# EAGLE design PocketLEDs (EAGLE 7.7.0)
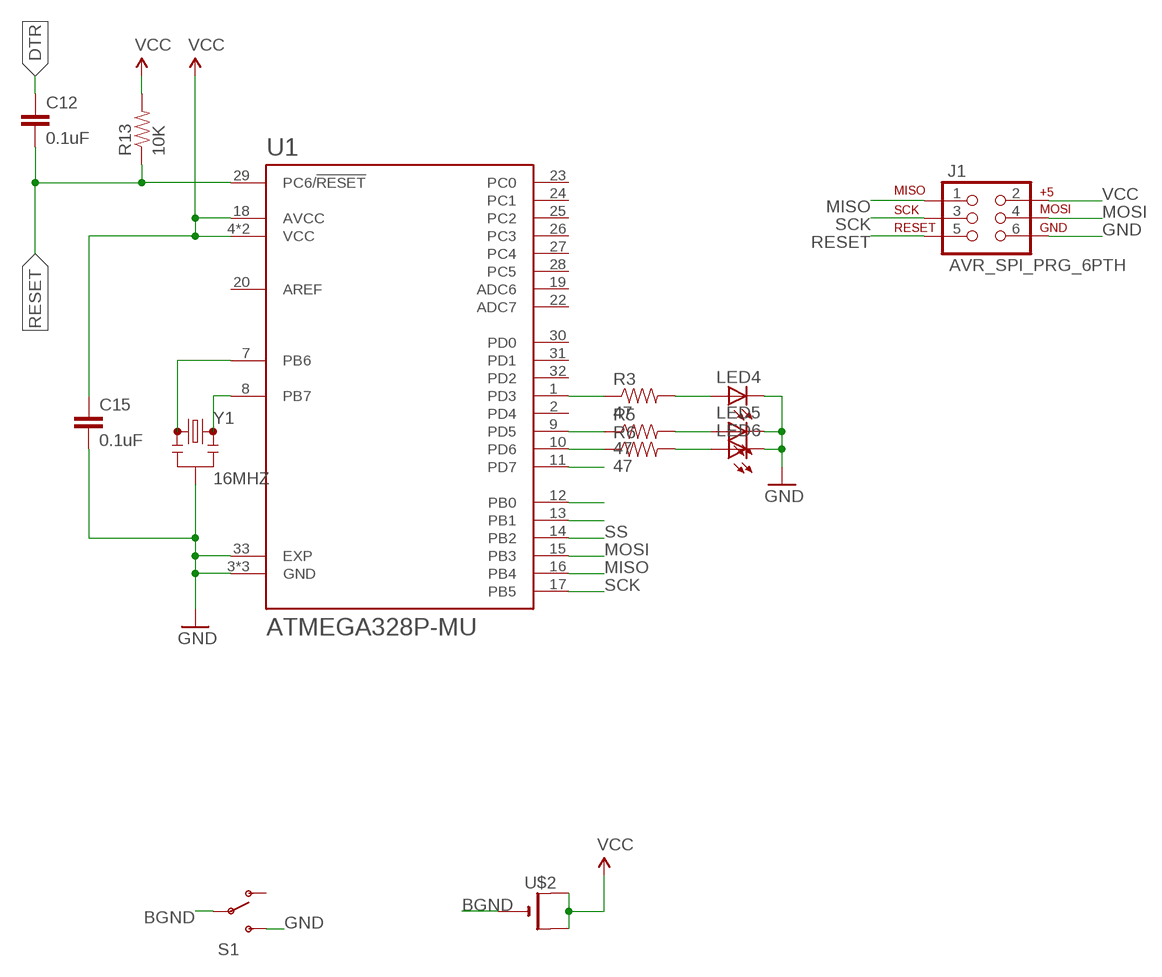
[diagram p0: schematic, sheet 1]

## Parts
C12  0.1uF  CAP0805  [0805]
C15  0.1uF  CAP0805  [0805]
J1  AVR_SPI_PRG_6PTH  [2X3]
LED4  LEDCHIPLED_0805  [CHIPLED_0805]
LED5  LEDCHIPLED_0805  [CHIPLED_0805]
LED6  LEDCHIPLED_0805  [CHIPLED_0805]
R3  47  RESISTOR0805-RES  [0805]
R5  47  RESISTOR0805-RES  [0805]
R6  47  RESISTOR0805-RES  [0805]
R13  10K  RESISTOR0805-RES  [0805]
S1  SWITCH-SPDT-SMD-A  [SWITCH-SPST-SMD-A]
U1  ATMEGA328P-MU  [QFN50P500X500X100-33N]
U$2  CR2032THM  [CR2032-THRU]
Y1  16MHZ  RESONATOR16MHZ  [RESONATOR-SMD]

## Nets
BGND: S1.2(P) U$2.-
DTR: C12.1
GND: C15.2 J1.6 LED4.C LED5.C LED6.C S1.3(S) U1.3(GND) U1.5(GND) U1.21(GND) U1.33(EXP) Y1.2
MISO: J1.1 U1.16(PB4)
MOSI: J1.4 U1.15(PB3)
N$1: U1.12(PB0)
N$2: U1.11(PD7)
N$7: R3.1 U1.1(PD3)
N$8: LED4.A R3.2
N$9: R5.1 U1.9(PD5)
N$10: LED5.A R5.2
N$11: U1.8(PB7) Y1.3
N$12: U1.7(PB6) Y1.1
N$13: R6.1 U1.10(PD6)
N$14: LED6.A R6.2
N$15: U1.13(PB1)
RESET: C12.2 J1.5 R13.1 U1.29(PC6/!RESET)
SCK: J1.3 U1.17(PB5)
SS: U1.14(PB2)
VCC: C15.1 J1.2 R13.2 U1.4(VCC) U1.6(VCC) U1.18(AVCC) U$2.+1(+) U$2.+2(+1)
Unconnected: S1.1(O) U1.2(PD4) U1.19(ADC6) U1.20(AREF) U1.22(ADC7) U1.23(PC0) U1.24(PC1) U1.25(PC2) U1.26(PC3) U1.27(PC4) U1.28(PC5) U1.30(PD0) U1.31(PD1) U1.32(PD2)

## Library data of the parts
C12 C15 = SparkFun-Passives:CAP: Capacitor Standard 0603 ceramic capacitor, and 0.1" leaded capacitor.
J1 = SparkFun-Connectors:AVR_SPI_PRG_6: AVR ISP 6 Pin This is the reduced ISP connector for AVR programming. Common on Arduino. This footprint will take up less PCB space and can be used with a 10-pin to 6-pin adapter such as SKU: BOB-08508 **Special note about "TEST_POINT" package. The stop mask is on the top side, so if you want your programming test points to be on the bottom of your board, make sure to place this package on the bottom side of the board. This also ensure that the orientation to program from the bottom side will be correct.
LED4-LED6 = adafruit:LED: LED OSRAM: - CHIPLED LG R971, LG N971, LY N971, LG Q971, LY Q971, LO R971, LY R971 LH N974, LH R974 LS Q976, LO Q976, LY Q976 LO Q996 - Hyper CHIPLED LW Q18S LB Q993, LB Q99A, LB R99A - SideLED LS A670, LO A670, LY A670, LG A670, LP A670 LB A673, LV A673, LT A673, LW A673 LH A674 LY A675 LS A676, LA A676, LO A676, LY A676, LW A676 LS A679, LY A679, LG A679 - Hyper Micro SIDELED® LS Y876, LA Y876, LO Y876, LY Y876 LT Y87S - SmartLED LW L88C, LW L88S LB L89C, LB L89S, LG L890 LS L89K, LO L89K, LY L89K LS L896, LA L896, LO L896, LY L896 - TOPLED LS T670, LO T670, LY T670, LG T670, LP T670 LSG T670, LSP T670, LSY T670, LOP T670, LYG T670 LG T671, LOG T671, LSG T671 LB T673, LV T673, LT T673, LW T673 LH T674 LS T676, LA T676, LO T676, LY T676, LB T676, LH T676, LSB T676, LW T676 LB T67C, LV T67C, LT T67C, LS T67K, LO T67K, LY T67K, LW E67C LS E67B, LA E67B, LO E67B, LY E67B, LB E67C, LV E67C, LT E67C LW T67C LS T679, LY T679, LG T679 LS T770, LO T770, LY T770, LG T770, LP T770 LB T773, LV T773, LT T773, LW T773 LH T774 LS E675, LA E675, LY E675, LS T675 LS T776, LA T776, LO T776, LY T776, LB T776 LHGB T686 LT T68C, LB T68C - Hyper Mini TOPLED® LB M676 - Mini TOPLED Santana® LG M470 LS M47K, LO M47K, LY M47K Source: http://www.osram.convergy.de/; OC_NEWARK: unknown
R3 R5 R6 = SparkFun-Resistors:RESISTOR: Resistor Basic schematic elements and footprints for 0603, 1206, and PTH resistors.; OC_NEWARK: unknown
R13 = SparkFun-Passives:RESISTOR: Resistor Basic schematic elements and footprints for 0603, 1206, and PTH resistors.
S1 = SparkFun-Electromechanical:SWITCH-SPDT: SPDT Switch Simple slide switch, Spark Fun Electronics SKU : COM-00102 DPDT SMT slide switch, AYZ0202, SWCH-08179; PROD_ID: SWCH-10651
U1 = ATMEGA328P-MU:ATMEGA328P-MU: ATmega Series 20 MHz 32 KB Flash 2 KB SRAM 8-Bit Microcontroller - QFN-32; AVAILABILITY: Good; DESCRIPTION: ATmega Series 20 MHz 32 KB Flash 2 KB SRAM 8-Bit Microcontroller - QFN-32; MF: Atmel; MP: ATMEGA328P-MU; PACKAGE: QFN-32 Atmel; PRICE: 2.55 USD
U$2 = adafruit:CR2032
Y1 = SparkFun-FreqCtrl:RESONATOR: Resonator Small SMD resonator. Used, eg, on the Arduino Pro/ Pro Mini boards. 8MHz- XTAL-08895 16MHz- XTAL-08900; OC_NEWARK: unknown; PROD_ID: XTAL-08900

## Board
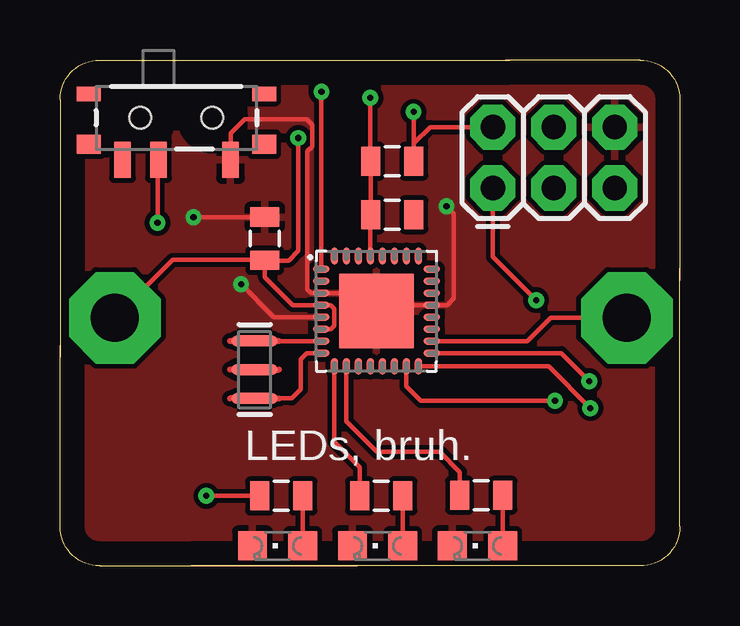
[diagram p1: board, top side]
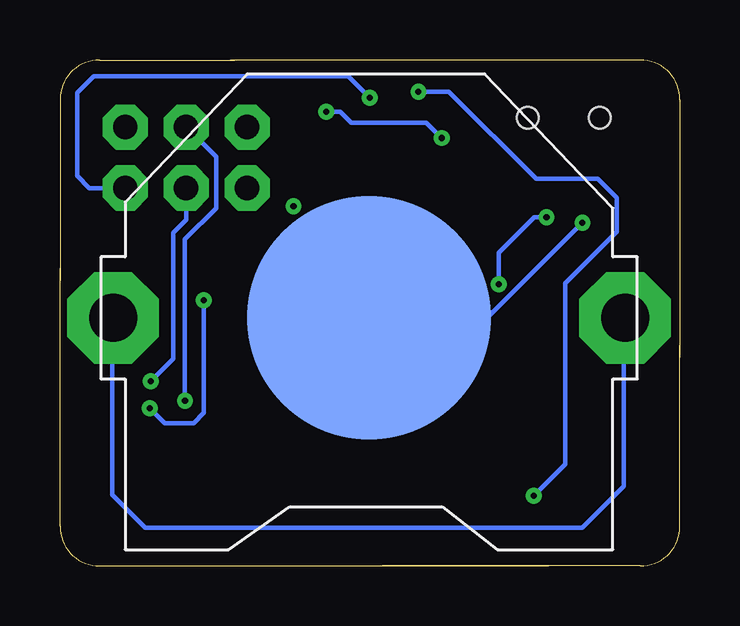
[diagram p2: board, bottom side, seen from below]

Size 25.83 x 21.08 mm. Coordinates in mm from the lower left corner, seen from the top.
Outline: 0,8.69 0,19.43 arc-90 1.65,21.08 18.75,21.08
Outline: 0,9.19 0,1.65 arc90 1.65,0 12.39,0
Outline: 25.83,12.4 25.83,1.65 arc-90 24.18,0 5.46,0
Outline: 25.83,11.89 25.83,19.43 arc90 24.18,21.08 18.54,21.08
Copper layers (1*16): Top 0.035mm / dielectric 1.5mm / Bottom 0.035mm
Design rules "default": minimum track width 10mil, minimum drill 24mil, track to track 8mil, track to pad 8mil, pad to pad 8mil, via to via 8mil, smd to smd 8mil, copper to edge 40mil, drill to drill 8mil, minimum pad ring 10mil, minimum via ring 8mil, stop-mask expansion 4mil, vias tented up to drill 0mil, thermal gap 10mil

### Footprints (pad centres in the part's own frame; a part is rotated, then mirrored left to right if it is on the bottom)
0805 = smd 0.8 x 1.2: 1 -0.9,0; 2 0.9,0
2X3 = drill 1.016 pad 1.88 octagon: 1 0,0; 2 0,2.54; 3 2.54,0; 4 2.54,2.54; 5 5.08,0; 6 5.08,2.54
CHIPLED_0805 = smd 1.2 x 1.2: A 0,-1.05; C 0,1.05
SWITCH-SPST-SMD-A = smd 0.7 x 1.5: 1 -2.25,-1.75; 2 -0.75,-1.75; 3 2.25,-1.75 | smd 1 x 0.6: GND1 -3.65,1; GND3 3.65,1 | smd 1 x 0.8: GND2 -3.65,-1.1; GND4 3.65,-1.1 | hole 0.9: -1.5,0; 1.5,0
QFN50P500X500X100-33N = smd 0.7 x 0.3: 1 -2.3,1.75; 2 -2.3,1.25; 3 -2.3,0.75; 4 -2.3,0.25; 5 -2.3,-0.25; 6 -2.3,-0.75; 7 -2.3,-1.25; 8 -2.3,-1.75; 17 2.3,-1.75; 18 2.3,-1.25; 19 2.3,-0.75; 20 2.3,-0.25; 21 2.3,0.25; 22 2.3,0.75; 23 2.3,1.25; 24 2.3,1.75 | smd 0.3 x 0.7: 9 -1.75,-2.3; 10 -1.25,-2.3; 11 -0.75,-2.3; 12 -0.25,-2.3; 13 0.25,-2.3; 14 0.75,-2.3; 15 1.25,-2.3; 16 1.75,-2.3; 25 1.75,2.3; 26 1.25,2.3; 27 0.75,2.3; 28 0.25,2.3; 29 -0.25,2.3; 30 -0.75,2.3; 31 -1.25,2.3; 32 -1.75,2.3 | smd 3.1 x 3.1: 33 0,0
CR2032-THRU = drill 2 pad 3.81 octagon: +1 -10.668,0; +2 10.668,0 | smd 10.16 x 10.16: - 0,0
RESONATOR-SMD = smd 0.45 x 1.905: 1 -1.2,0; 2 0,0; 3 1.2,0

### Placement (x,y rotation side)
C12  13.84,14.63 180 top
C15  8.53,13.64 90 top
J1  18.03,15.75 0 top
LED4  9.07,0.84 90 top
LED5  13.23,0.84 90 top
LED6  17.4,0.84 90 top
R3  9.22,2.92 0 top
R5  13.39,2.92 0 top
R6  17.55,2.95 0 top
R13  13.84,16.87 0 top
S1  4.85,18.67 0 top
U1  13.18,10.62 0 top
U$2  12.95,10.34 180 bottom
Y1  8.1,8.18 270 top

### Tracks (layer width: path | path; a pad name or v marks a point on that pad's centre or on a via)
BGND  (via drill 0.25 pad 0.3)
  Top 0.178: v4.06,14.3 4.06,16.88 S1.2
  Bottom 0.178: U$2.- 8.03,10.34 v4.06,14.3
GND  (via drill 0.25 pad 0.13)
  Top 0.178: U1.5 8.91,10.37 v7.54,11.73 | C15.2 8.54,14.53 v5.56,14.53 | v16.1,14.99 16.41,14.68 16.41,11.15 16.12,10.87 U1.21 13.43,10.87 U1.33 12.43,11.37 U1.3 10.48,11.37 10.31,11.53 10.31,17.27 10.52,17.48 10.52,18.39 10.29,18.62 7.7,18.62 7.11,18.03 7.11,16.93 S1.3
  Bottom 0.178: v5.56,14.53 6.07,14.53 7.54,13.06 v7.54,11.73
  pour Top: -0.99,22.15 -0.99,-1.65 26.62,-1.65 26.62,22.05
MISO  (via drill 0.25 pad 0.13)
  Top 0.178: J1.1 18.03,12.88 v19.84,11.07 | U1.16 20.36,8.32 v22.1,6.58
  Bottom 0.178: v19.84,11.07 19.84,6.38 20.27,5.94 21.46,5.94 v22.1,6.58
MOSI  (via drill 0.25 pad 0.13)
  Top 0.178: U1.15 14.43,7.49 15.04,6.88 v20.62,6.88
  Bottom 0.178: J1.4 19.33,17.04 19.33,14.91 20.62,13.61 v20.62,6.88
N$7  (via drill 0.25 pad 0.3)
  Top 0.178: v6.1,2.92 R3.1 | U1.1 10.88,19.75 v10.9,19.76
  Bottom 0.178: v10.9,19.76 9.63,19.76 5.99,16.13 3.43,16.13 2.64,15.34 2.64,13.92 4.78,11.79 4.78,4.24 v6.1,2.92
N$8
  Top 0.178: LED4.A R3.2
N$9
  Top 0.178: U1.9 11.43,5.18 12.5,4.11 12.5,2.93 R5.1
N$10
  Top 0.178: LED5.A R5.2
N$11
  Top 0.178: U1.8 10.29,8.87 10.03,8.61 10.03,7.37 9.65,6.99 9.12,6.99 9.12,6.98
N$12
  Top 0.178: U1.7 9.13,9.37 9.12,9.38
N$13
  Top 0.178: U1.10 11.93,6.03 13.21,4.75 15.82,4.75 16.66,3.91 16.66,2.96 R6.1
N$14
  Top 0.178: LED6.A R6.2
RESET  (via drill 0.25 pad 0.3)
  Top 0.178: U1.29 C12.2 R13.1 12.93,16.88 v12.93,19.51
  Bottom 0.178: J1.5 24.61,15.75 25.12,16.26 25.12,19.71 24.43,20.4 13.82,20.4 v12.93,19.51
SCK  (via drill 0.25 pad 0.13)
  Top 0.178: U1.17 20.88,8.86 v22.05,7.7
  Bottom 0.178: J1.3 20.57,14.43 21.11,13.89 21.11,8.64 v22.05,7.7
VCC  (via drill 0.25 pad 0.13)
  Top 0.178: C15.1 8.52,12.75 4.7,12.75 U$2.+1 | C15.1 8.53,12.04 9.71,10.87 U1.4 11.28,10.87 11.43,10.72 11.43,10.01 11.29,9.87 U1.6 10.71,9.87 | J1.2 15.42,18.29 14.74,17.61 R13.2 14.74,18.91 v14.73,18.92 | U1.18 19.48,9.37 20.45,10.34 U$2.+2 | v9.93,17.83 9.93,13.13 9.53,12.73 8.55,12.73 C15.1
  Bottom 0.178: U$2.+2 23.65,10.31 23.65,2.97 22.28,1.6 4.06,1.6 2.34,3.33 2.34,10.29 U$2.+1 | v14.73,18.92 14.15,18.92 13.69,18.47 10.57,18.47 v9.93,17.83

### Text on the board
_tsilk: LEDs, bruh.